# Altium project ESP_Print.PrjPcb
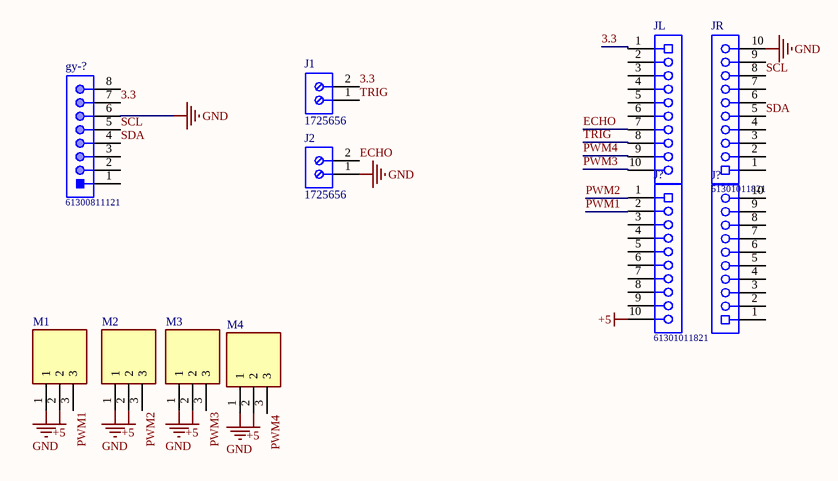
[diagram p0: ESP_Print1.SchDoc]
1 sheet, 11 parts. Net scope: global (net labels, ports and power ports of the same name join across sheets).
Board file: PCB2.PcbDoc

## Sheet ESP_Print1.SchDoc
size A4; SheetNumber: 1; SheetTotal: 1

### Parts
(Parts that share a designator on the sheet are numbered #1, #2 ... from top to bottom, then left to right.)
gy-?  61300811121  [61300811121]
J1  1725656  [PHOE-1725656-2]
J2  1725656  [PHOE-1725656-2]
J?#1  61301011821  [61301011821]
J?#2  (no value)  [61301011821]
JL  (no value)  [61301011821]
JR  61301011821  [61301011821]
M1  (no value)  [TE_1986717-3]
M2  (no value)  [TE_1986717-3]
M3  (no value)  [TE_1986717-3]
M4  (no value)  [TE_1986717-3]

### Nets
+5: J?#1.10 M1.2 M2.2 M3.2 M4.2
GND: gy-?.6 J2.1 JR.10 M1.1 M2.1 M3.1 M4.1
3.3: gy-?.7 J1.2 JL.1
ECHO: J2.2 JL.7
PWM1: J?#1.2 M1.3
PWM2: J?#1.1 M2.3
PWM3: JL.10 M3.3
PWM4: JL.9 M4.3
SCL: gy-?.5 JR.8
SDA: gy-?.4 JR.5
TRIG: J1.1 JL.8

Not connected (* = marked no-connect by the designer): gy-? 1 2 3 8; J?#1 3 4 5 6 7 8 9; J?#2 1 2 3 4 5 6 7 8 9 10; JL 2 3 4 5 6; JR 1 2 3 4 6 7 9

### Library data of the parts
gy-? = CMP-1502-01076-1: THT Vertical Pin Header WR-PHD, Pitch 2.54 mm, Single Row, 8 pins; Manufacturer: Wurth Elektronik; Rated Current: 3A; Pin Number: 8; Working Voltage: 250VAC; Gender: Male; Contact Resistance: 20mOhm; Pitch: 2.54mm; Withstanding Voltage: 500VAC; Publisher: WurthElektronik; Operating Temperature: -40to105degC; Orientation: Vertical; Row Number: Single; Part Number: 61300811121; Package Reference: 61300811121; Mounting Technology: THT; Packaging: Bag; Manufacturer URL: http://www.we-online.de; Datasheet URL: https://katalog.we-online.de/em/datasheet/6130xx11121.pdf
J1 J2 = CMP-2000-05299-1: Male Header, Pitch 2.54 mm, 1 x 2 Position, Height 9 mm, Tail Length 3.5 mm; Manufacturer: Phoenix Contact; Number of contacts: 2; Content: 250pc(s); Pitch: 2.54mm; Industrial packaging: Yes; Colour: Green; Manufacturer part No.: 1725656; Type: MPT0,5/2-2,54; Datasheet URL: http://datasheet.octopart.com/1725656-Phoenix-Contact-datasheet-5302866.pdf; Manufacturer URL: http://www.phoenixcontact.com/; Datasheet Version: Apr-08
J?#1 J?#2 JL JR = CMP-1502-01332-1: THT Vertical Socket Header WR-PHD, Pitch 2.54 mm, Single Row, 10 pins; Manufacturer: Wurth Elektronik; Rated Current: 3A; Working Voltage: 250VAC; Gender: Female; Pitch: 2.54mm; Contact Resistance: 20mOhm; Pin Number: 10; Withstanding Voltage: 500VAC; Publisher: WurthElektronik; Orientation: Vertical; Row Number: Single; Package Reference: 61301011821; Packaging: Tray; Datasheet URL: https://katalog.we-online.de/em/datasheet/6130xx11821.pdf; Operating Temperature: -40to125degC; Part Number: 61301011821; Manufacturer URL: http://www.we-online.de; Mounting Technology: THT
M1-M4 = 1986717-3: 3 Position Terminal Block Header, Male Pins, Unshrouded 0.138 _3.50mm_ Vertical Through Hole; Number_of_Positions: 3; Centerline_Pitch: 3.5 mm[.138 in]; MF: TE Connectivity; Package: None; Value: *; TE_purchase_URL: https://www.te.com/usa-en/product-1986717-3.html?te_bu=Cor&te_type=disp&te_campaign=seda_glo_cor-seda-global-disp-prtnr-fy19-seda-model-bom-cta_sma-317_1&elqCampaignId=32493; SnapEDA_Link: https://www.snapeda.com/parts/1986717-3/TE%20Connectivity%20AMP%20Connectors/view-part/479222/?ref=snap; Availability: Unavailable; Price: None; MP: 1986717-3